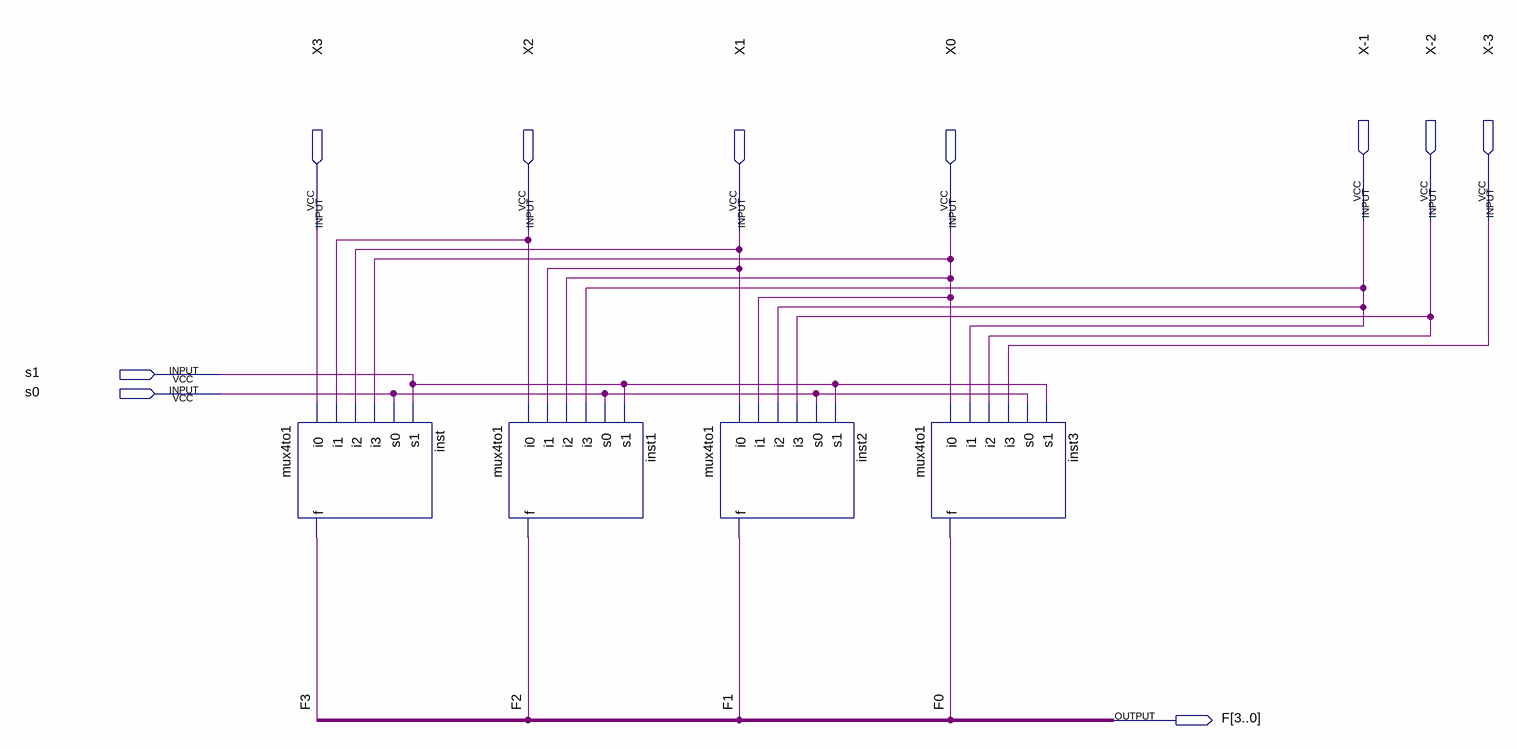
[diagram p0: schematic sheet]
// Quartus schematic lab8step2.bdf as structural Verilog: 4 symbols, 10 pins
module lab8step2 (
  input  \X-1 ,
  input  \X-2 ,
  input  \X-3 ,
  input  X3,
  input  X2,
  input  X1,
  input  X0,
  input  s1,
  input  s0,
  output [3:0] F
);

  mux4to1 inst (.i0(X3), .i1(X2), .i2(X1), .i3(X0), .s0(s0), .s1(s1), .f(F[3]));
  mux4to1 inst1 (.i0(X2), .i1(X1), .i2(X0), .i3(\X-1 ), .s0(s0), .s1(s1), .f(F[2]));
  mux4to1 inst2 (.i0(X1), .i1(X0), .i2(\X-1 ), .i3(\X-2 ), .s0(s0), .s1(s1), .f(F[1]));
  mux4to1 inst3 (.i0(X0), .i1(\X-1 ), .i2(\X-2 ), .i3(\X-3 ), .s0(s0), .s1(s1), .f(F[0]));
endmodule
